# EAGLE design 150308-1-eRIC-Nitro-v1.2 (EAGLE 7.3.0)
NRS: 150308-1; REV: v1.1
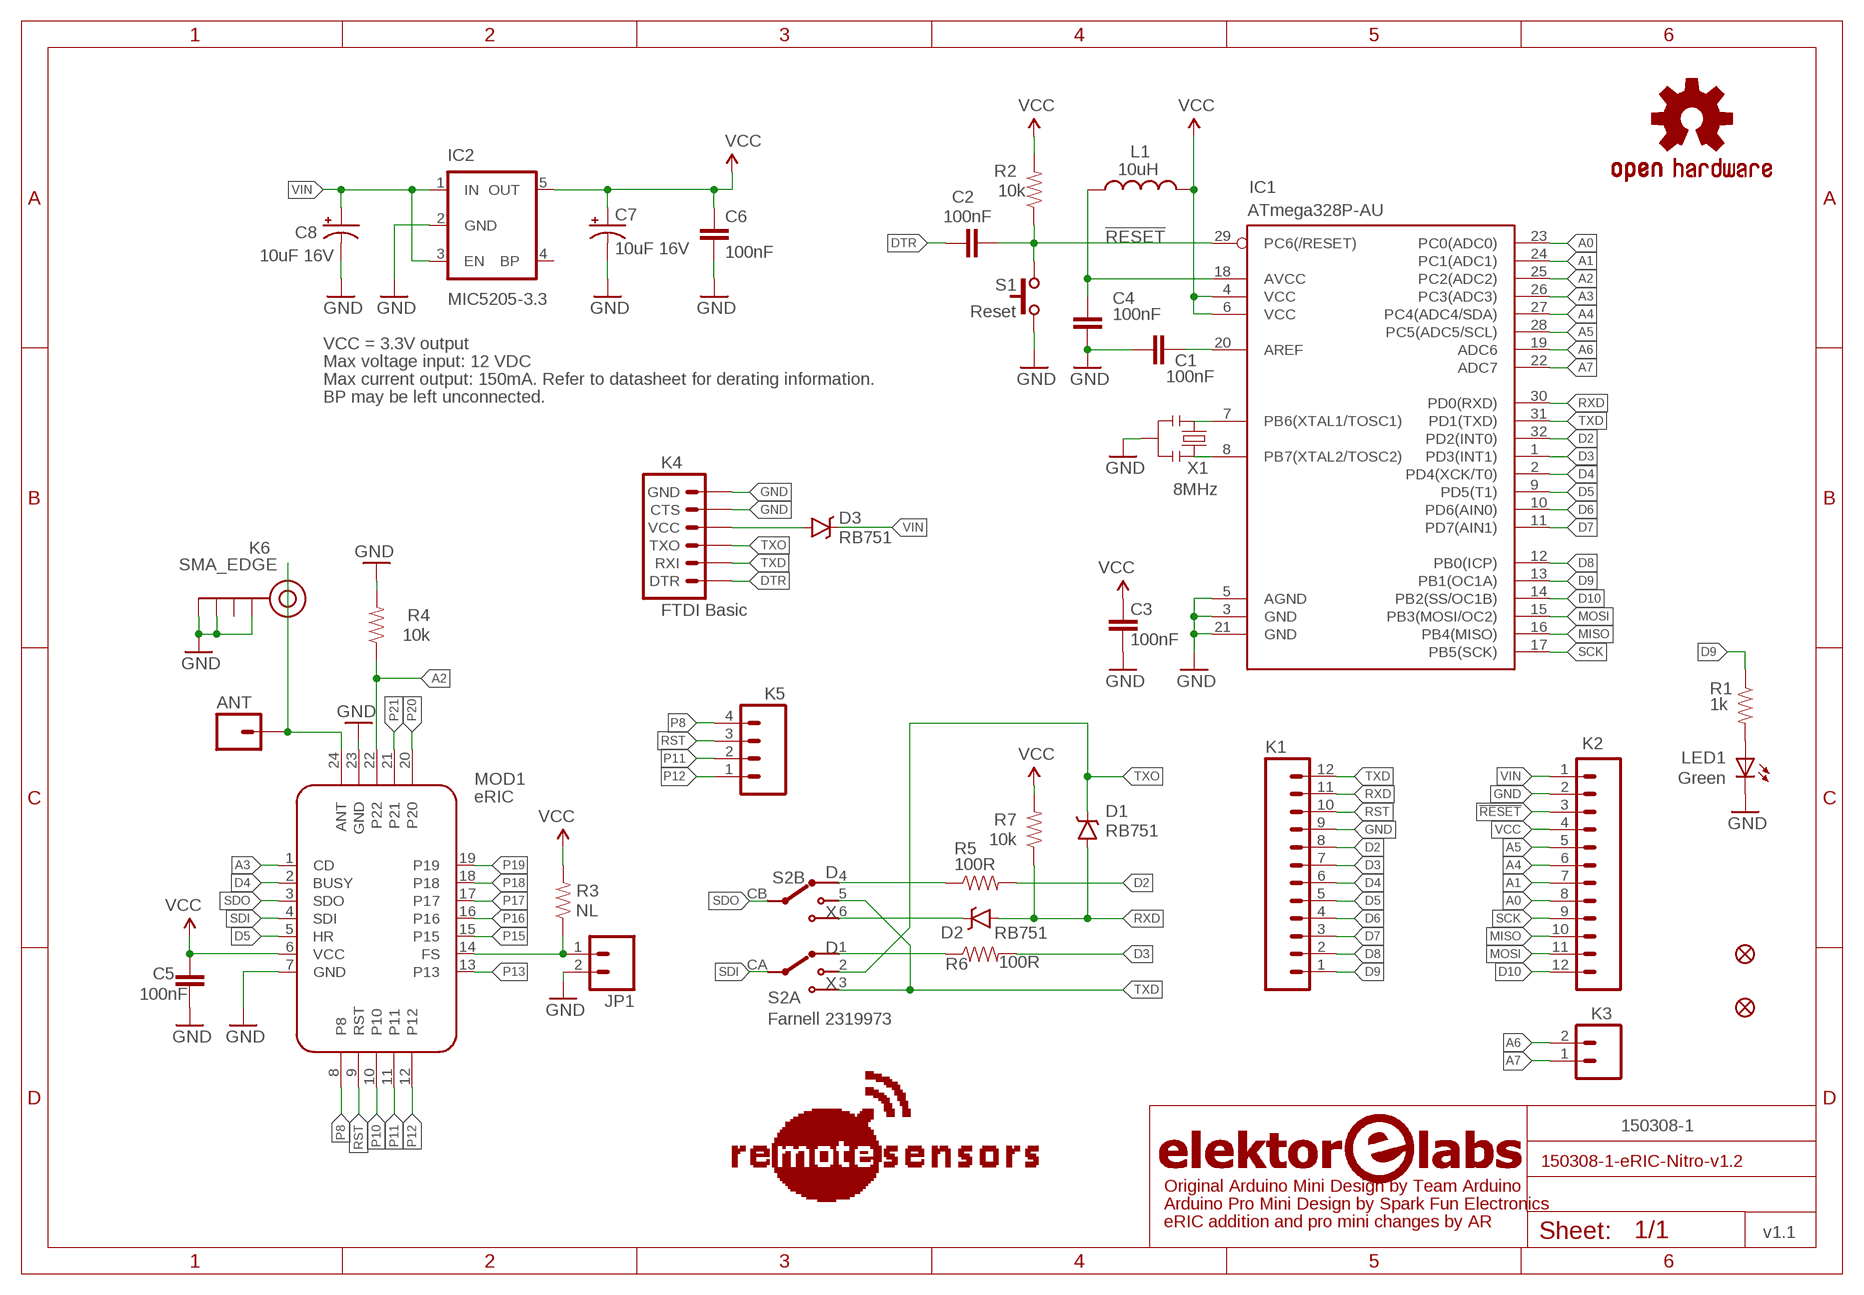
[diagram p0: schematic, sheet 1]

## Parts
ANT  M01PTH  [1X01-080]
C1  100nF  CAP0603-CAP  [0603-CAP]
C2  100nF  CAP0603-CAP  [0603-CAP]
C3  100nF  CAP0603-CAP  [0603-CAP]
C4  100nF  CAP0603-CAP  [0603-CAP]
C5  100nF  CAP0603-CAP  [0603-CAP]
C6  100nF  CAP0603-CAP  [0603-CAP]
C7  10uF 16V  CAP_POL1206  [EIA3216]
C8  10uF 16V  CAP_POL1206  [EIA3216]
D1  RB751  [SOD-523]
D2  RB751  [SOD-523]
D3  RB751  [SOD-523]
FID1  FIDUCIALUFIDUCIAL  [MICRO-FIDUCIAL]
FID2  FIDUCIALUFIDUCIAL  [MICRO-FIDUCIAL]
IC1  ATmega328P-AU  ATMEGA168  [TQFP32-08]
IC2  MIC5205-3.3  V_REG_LDOSMD  [SOT23-5]
JP1  M02PTH  [1X02]
K1  M12PTH  [1X12]
K2  M12PTH  [1X12]
K3  M02PTH  [1X02]
K4  FTDI Basic  ARDUINO_SERIAL_PROGRAMPTH  [1X06]
K5  M04PTH  [1X04]
K6  SMA_EDGE  [SMA-EDGE]
L1  10uH  INDUCTOR0603  [0603]
LED1  Green  LED  [0603-LED-ALT1]
LOGO1  OSHW-LOGOS  [OSHW-LOGO-S]
LOGO2  LOGO-ELEKTOR-LABS-25MM  [ELPP-LOGO-ELEKTOR-LABS-25MM]
LOGO3  LOGO-REMOTE-SENSORS-17MM  [LOGO-REMOTE-SENSORS2]
MOD1  eRIC  ERIC  [ERIC]
R1  1k  RESISTOR0603-RES  [0603-RES]
R2  10k  RESISTOR0603-RES  [0603-RES]
R3  NL  RESISTOR0603-RES  [0603-RES]
R4  10k  RESISTOR0603-RES  [0603-RES]
R5  100R  RESISTOR0603-RES  [0603-RES]
R6  100R  RESISTOR0603-RES  [0603-RES]
R7  10k  RESISTOR0603-RES  [0603-RES]
S1  Reset  SWITCH-MOMENTARY-2SMD-ALT04  [TACTILE-SWITCH-SMD-ALT04]
S2  AYZ0203AGRLC  [AYZ0203]
X1  8MHz  RESONATORSMD  [RESONATOR-SMD]

## Nets
!RESET!: C2.1 IC1.29(PC6(/RESET)) K2.3 R2.1 S1.3 S1.4
A0: IC1.23(PC0(ADC0)) K2.8
A1: IC1.24(PC1(ADC1)) K2.7
A2: IC1.25(PC2(ADC2)) MOD1.22 R4.1
A3: IC1.26(PC3(ADC3)) MOD1.1(CD)
A4: IC1.27(PC4(ADC4/SDA)) K2.6
A5: IC1.28(PC5(ADC5/SCL)) K2.5
A6: IC1.19(ADC6) K3.2
A7: IC1.22(ADC7) K3.1
ANTENNE: ANT.1 K6.SIG(SIGNAL) MOD1.24(ANT)
D2: IC1.32(PD2(INT0)) K1.8 R5.2
D3: IC1.1(PD3(INT1)) K1.7 R6.2
D4: IC1.2(PD4(XCK/T0)) K1.6 MOD1.2(BUSY)
D5: IC1.9(PD5(T1)) K1.5 MOD1.5(HR)
D6: IC1.10(PD6(AIN0)) K1.4
D7: IC1.11(PD7(AIN1)) K1.3
D8: IC1.12(PB0(ICP)) K1.2
D9: IC1.13(PB1(OC1A)) K1.1 R1.1
D10: IC1.14(PB2(SS/OC1B)) K2.12
DTR: C2.2 K4.1(DTR)
FS: JP1.1 MOD1.14(FS) R3.1
GND [vcc]: C1.1 C3.1 C4.1 C5.1 C6.2 C7.C(-) C8.C(-) IC1.3(GND) IC1.5(AGND) IC1.21(GND) IC2.2(GND) JP1.2 K1.9 K2.2 K4.5(CTS) K4.6(GND) K6.GND@0(GND) K6.GND@2(GND) K6.GND@3(GND) LED1.C MOD1.7(GND) MOD1.23(GND) R4.2 S1.1 S1.2 X1.2
MISO: IC1.16(PB4(MISO)) K2.10
MOSI: IC1.15(PB3(MOSI/OC2)) K2.11
N$1: IC1.8(PB7(XTAL2/TOSC2)) X1.3
N$2: IC1.7(PB6(XTAL1/TOSC1)) X1.1
N$3: C1.2 IC1.20(AREF)
N$4: C4.2 IC1.18(AVCC) L1.1
N$5: LED1.A R1.2
N$6: D3.A K4.4(VCC)
N$8: R5.1 S2.4
N$9: D2.C S2.6
N$10: R6.1 S2.1
P8: K5.4 MOD1.8
P10: MOD1.10
P11: K5.2 MOD1.11
P12: K5.1 MOD1.12
P13: MOD1.13
P15: MOD1.15
P16: MOD1.16
P17: MOD1.17
P18: MOD1.18
P19: MOD1.19
P20: MOD1.20
P21: MOD1.21
RST: K1.10 K5.3 MOD1.9(RST)
RXD: D1.A D2.A IC1.30(PD0(RXD)) K1.11 R7.1
SCK: IC1.17(PB5(SCK)) K2.9
SDI: MOD1.4(SDI) S2.CA
SDO: MOD1.3(SDO) S2.CB
TXD: IC1.31(PD1(TXD)) K1.12 K4.2(RXI) S2.3 S2.5
TXO: D1.C K4.3(TXO) S2.2
VCC: C3.2 C5.2 C6.1 C7.A(+) IC1.4(VCC) IC1.6(VCC) IC2.5(OUT) K2.4 L1.2 MOD1.6(VCC) R2.2 R3.2 R7.2
VIN [vcc]: C8.A(+) D3.C IC2.1(IN) IC2.3(EN) K2.1
Unconnected: IC2.4(BP) K6.GND@1(GND)

## Notes on the sheet
- VCC = 3.3V output
- Max voltage input: 12 VDC
- Max current output: 150mA. Refer to datasheet for derating information.
- BP may be left unconnected.
- D
- X
- D
- X
- Farnell 2319973
- Original Arduino Mini Design by Team Arduino
- Arduino Pro Mini Design by Spark Fun Electronics
- eRIC addition and pro mini changes by AR

## Library data of the parts
ANT = 150308-1-eRIC-Nitro:M01: Header 1 Standard 1-pin 0.1" header. Use with straight break away headers (SKU : PRT-00116), right angle break away headers (PRT-00553), swiss pins (PRT-00743), machine pins (PRT-00117), and female headers (PRT-00115).
C1-C6 = SparkFun:CAP: Capacitor Standard 0603 ceramic capacitor, and 0.1" leaded capacitor.
C7 C8 = 150308-1-eRIC-Nitro:CAP_POL: Capacitor Polarized These are standard SMD and PTH capacitors. Normally 10uF, 47uF, and 100uF in electrolytic and tantalum varieties. Always verify the external diameter of the through hole cap, it varies with capacity, voltage, and manufacturer. The EIA devices should be standard.
D1-D3 = 150308-1-eRIC-Nitro:RB751: 40V 120mA SOD-523 Schottky DIO-11018; PROD_ID: DIO-11018
FID1 FID2 = SparkFun:FIDUCIAL: Fiducial Alignment Points Various fiducial points for machine vision alignment.
IC1 = SparkFun:ATMEGA168
IC2 = 150308-1-eRIC-Nitro:V_REG_LDO: Voltage Regulator LDO Standard 150mA LDO voltage regulator in SOT-23 layout. Micrel part MIC5205. BP (by-pass) pin is used to lower output noise with 470pF cap.
JP1 K3 = 150308-1-eRIC-Nitro:M02: Header 2 Standard 2-pin 0.1" header. Use with straight break away headers (SKU : PRT-00116), right angle break away headers (PRT-00553), swiss pins (PRT-00743), machine pins (PRT-00117), and female headers (PRT-00115). Molex polarized connector foot print use with SKU : PRT-08233 with associated crimp pins and housings.
K1 K2 = 150308-1-eRIC-Nitro:M12: Header 12 Standard 12-pin 0.1" header. Use with straight break away headers (SKU : PRT-00116), right angle break away headers (PRT-00553), swiss pins (PRT-00743), machine pins (PRT-00117), and female headers (PRT-00115).
K4 = 150308-1-eRIC-Nitro:ARDUINO_SERIAL_PROGRAM
K5 = 150308-1-eRIC-Nitro:M04: Header 4 Standard 4-pin 0.1" header. Use with straight break away headers (SKU : PRT-00116), right angle break away headers (PRT-00553), swiss pins (PRT-00743), machine pins (PRT-00117), and female headers (PRT-00115). Molex polarized connector foot print use with SKU : PRT-08231 with associated crimp pins and housings. 1MM SMD Version SKU: PRT-10208
K6 = 150308-1-eRIC-Nitro:SMA_EDGE: SMA Antenna Connector End launch SMA connector. The paste layer has been removed so that the connector can be hand soldered onto the board after reflow.
L1 = SparkFun-Passives:INDUCTOR: Inductors Basic Inductor/Choke - 0603 and 1206. Footprints are not proven and vary greatly between part numbers. INDUCTOR POWER 3.3UH 4.0A SMD 0.197" L x 0.197" W x 0.177" H (5.00mm x 5.00mm x 4.50mm)
LED1 = 150308-1-eRIC-Nitro:LED: LEDs Standard schematic elements and footprints for 5mm, 3mm, 1206, and 0603 sized LEDs. 5mm - Spark Fun Electronics SKU : COM-00529 (and others)
LOGO1 = SparkFun:OSHW-LOGO: Open Source Hardware Logo This logo indicates the piece of hardware it is found on incorporates a OSHW license and/or adheres to the definition of open source hardware found here: http://freedomdefined.org/OSHW
LOGO2 = 150308-1-eRIC-Nitro:LOGO-ELEKTOR-LABS: Logo, Elektor.Labs
LOGO3 = _Elektor2a:LOGO-REMOTE-SENSORS-: Logo remotesensors
MOD1 = eRIC-Nitro:ERIC: eRIC SoC Radio Transceiver Low Power Radio Solutions ( http://www.lprs.co.uk ) VCC: -0.3 to +6.0V I/O: -0.3 to +3.3V Operating Temperature: -40°C to 85°C Antenna: 50V p-p @ < 10MHz
R1-R4 R7 = SparkFun:RESISTOR: Resistor Basic schematic elements and footprints for 0603, 1206, and PTH resistors.
R5 R6 = SparkFun-Resistors:RESISTOR: Resistor Basic schematic elements and footprints for 0603, 1206, and PTH resistors.
S1 = 150308-1-eRIC-Nitro:SWITCH-MOMENTARY-2: Various NO switches- pushbuttons, reed, etc
S2 = 150308-1-eRIC-Nitro:AYZ0203: DP3T slide switch Two 3-way slide switches in one SMD package. C&K Components, AYZ0203
X1 = 150308-1-eRIC-Nitro:RESONATOR: Resonator Small SMD resonator. This is the itty bitty 10/20MHz resonators with built in caps. CSTCE10M0G55 and CSTCE20M0V53. Footprint for SMD has been used in SFE production for years, and does work okay. 1:1 is an attempt to get larger fillets on the sides so it will be easier to inspect these solders in our AOI machine. The pads have been minimized to match the actual metal under the resonator. To see this relation, it includes an image import of the bottom side of the component. Imported to scale on layer 200.

## Net classes
0 default: width 0.203 mm
1 vcc: width 0.254 mm

## Board
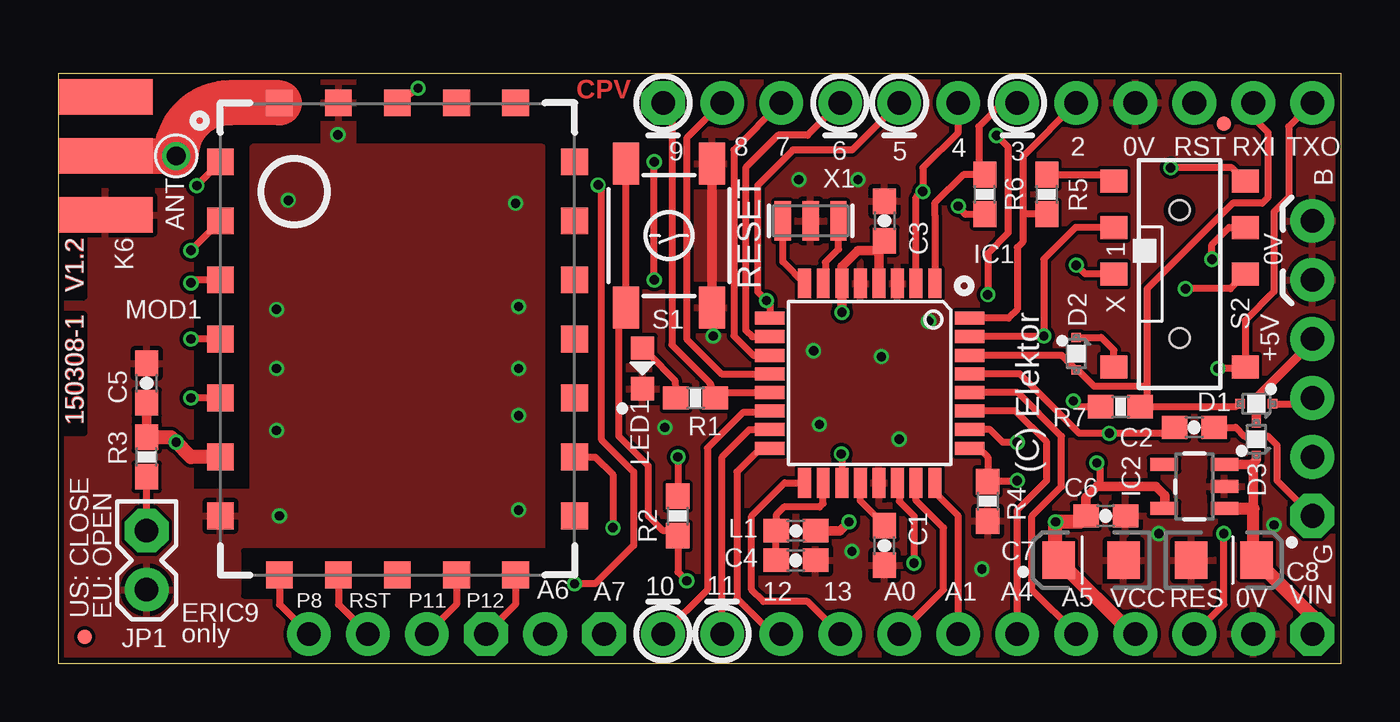
[diagram p1: board, top side]
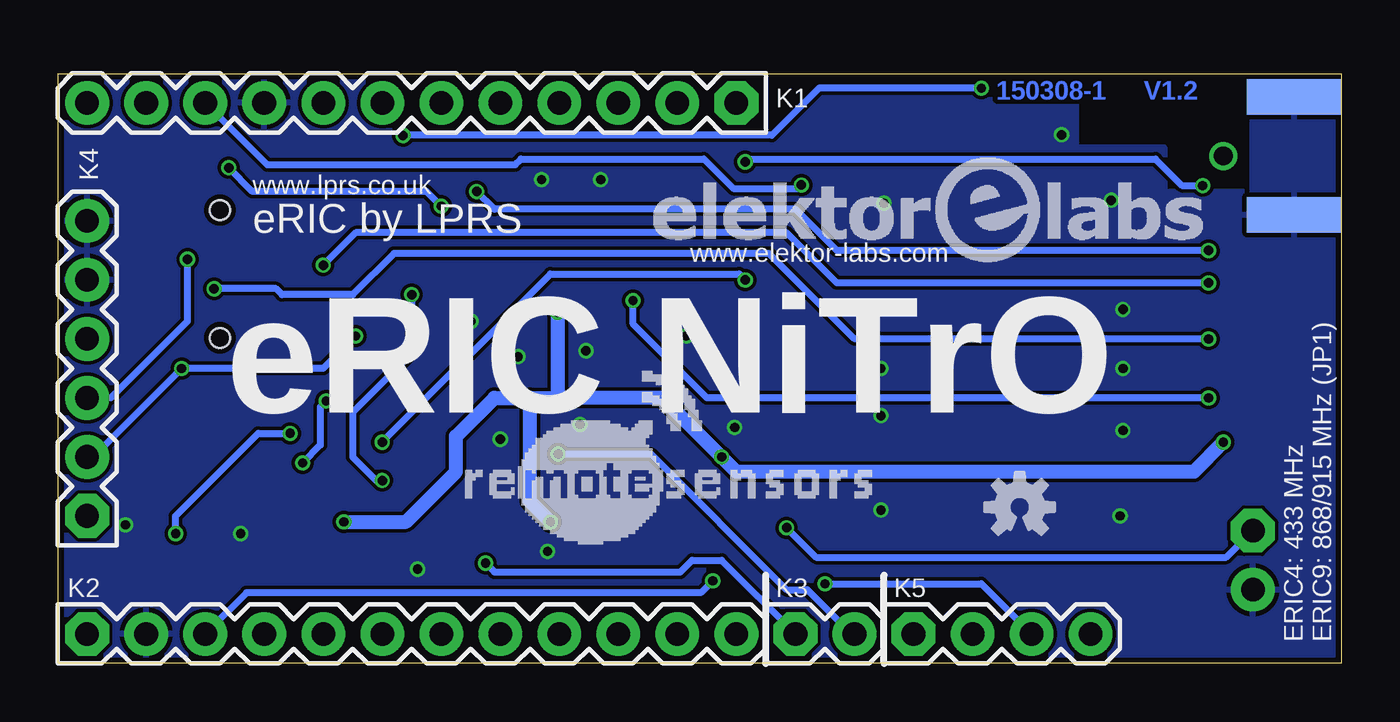
[diagram p2: board, bottom side, seen from below]

Size 55.23 x 25.39 mm. Coordinates in mm from the lower left corner, seen from the top.
Outline: 0,0 55.23,0 55.23,25.39 0,25.39 0,0
Copper layers (1*16): Top 0.018mm / dielectric 1.55mm / Bottom 0.018mm
Design rules "eC_2Layer_PClass6_BaseCopperO18_eCDefault *": minimum track width 0.15mm, minimum drill 0.35mm, track to track 0.15mm, track to pad 0.15mm, pad to pad 0.15mm, via to via 0.15mm, smd to smd 0mil, copper to edge 0.25mm, drill to drill 0.35mm, minimum pad ring 0.175mm, minimum via ring 0.125mm, stop-mask expansion 0mil, vias tented up to drill 0.5mm, thermal gap 0.2mm

### Footprints (pad centres in the part's own frame; a part is rotated, then mirrored left to right if it is on the bottom)
1X01-080 = drill 0.8: 1 0,0
0603-CAP = smd 1.1 x 1: 1 -0.85,0; 2 0.85,0
EIA3216 = smd 1.4 x 1.6: A 1.4,0; C -1.4,0
SOD-523 = smd 0.4 x 0.4: A -0.7,0; C 0.7,0
MICRO-FIDUCIAL = smd 0.635 x 0.635: 1 0,0
TQFP32-08 = smd 1.27 x 0.559: 1 -4.293,2.8; 2 -4.293,2; 3 -4.293,1.2; 4 -4.293,0.4; 5 -4.293,-0.4; 6 -4.293,-1.2; 7 -4.293,-2; 8 -4.293,-2.8; 17 4.293,-2.8; 18 4.293,-2; 19 4.293,-1.2; 20 4.293,-0.4; 21 4.293,0.4; 22 4.293,1.2; 23 4.293,2; 24 4.293,2.8 | smd 0.559 x 1.27: 9 -2.8,-4.293; 10 -2,-4.293; 11 -1.2,-4.293; 12 -0.4,-4.293; 13 0.4,-4.293; 14 1.2,-4.293; 15 2,-4.293; 16 2.8,-4.293; 25 2.8,4.293; 26 2,4.293; 27 1.2,4.293; 28 0.4,4.293; 29 -0.4,4.293; 30 -1.2,4.293; 31 -2,4.293; 32 -2.8,4.293
SOT23-5 = smd 0.55 x 1.2: 1 -0.95,-1.3; 2 0,-1.3; 3 0.95,-1.3; 4 0.95,1.3; 5 -0.95,1.3
1X02 = drill 1.016 pad 1.88 octagon: 1 0,0 | drill 1.016 pad 1.88: 2 2.54,0
1X12 = drill 1.016 pad 1.88 octagon: 1 0,0 | drill 1.016 pad 1.88: 2 2.54,0; 3 5.08,0; 4 7.62,0; 5 10.16,0; 6 12.7,0; 7 15.24,0; 8 17.78,0; 9 20.32,0; 10 22.86,0; 11 25.4,0; 12 27.94,0
1X06 = drill 1.016 pad 1.88 octagon: 1 0,0 | drill 1.016 pad 1.88: 2 2.54,0; 3 5.08,0; 4 7.62,0; 5 10.16,0; 6 12.7,0
1X04 = drill 1.016 pad 1.88 octagon: 1 0,0 | drill 1.016 pad 1.88: 2 2.54,0; 3 5.08,0; 4 7.62,0
SMA-EDGE = smd 1.524 x 4.064: GND@0 0,0; GND@1 5.08,0; SIG 2.54,0 | smd 1.524 x 4.064 bottom: GND@2 0,0; GND@3 5.08,0
0603 = smd 1.1 x 1: 1 -0.85,0; 2 0.85,0
0603-LED-ALT1 = smd 1 x 1: A 0,-0.877; C 0,0.877
ERIC = smd 1.15 x 1.15: 1 0,17.78; 2 0,15.24; 3 0,12.7; 4 0,10.16; 5 0,7.62; 6 0,5.08; 7 0,2.54; 8 2.54,0; 9 5.08,0; 10 7.62,0; 11 10.16,0; 12 12.7,0; 13 15.24,2.54; 14 15.24,5.08; 15 15.24,7.62; 16 15.24,10.16; 17 15.24,12.7; 18 15.24,15.24; 19 15.24,17.78; 20 12.7,20.32; 21 10.16,20.32; 22 7.62,20.32; 23 5.08,20.32; 24 2.54,20.32
0603-RES = smd 1.1 x 1: 1 -0.85,0; 2 0.85,0
TACTILE-SWITCH-SMD-ALT04 = smd 1.8 x 1.1: 1 -3.1,1.85; 2 3.1,1.85; 3 -3.1,-1.85; 4 3.1,-1.85
AYZ0203 = smd 1 x 1.15: 1 -4,2.825; 2 -2,2.825; 3 4,2.825; 4 -4,-2.825; 5 -2,-2.825; 6 4,-2.825; CA 0,2.825; CB 0,-2.825 | hole 0.85: 2.75,0; -2.75,0
RESONATOR-SMD = smd 0.7 x 1.7: 1 -1.2,0; 2 0,0; 3 1.2,0

### Placement (x,y rotation side)
ANT  5.08,21.84 90 top
C1  35.56,5.08 90 top
C2  48.89,10.16 0 top
C3  35.56,19.05 270 top
C4  31.75,4.45 180 top
C5  3.81,12.06 270 top
C6  45.09,6.35 0 top
C7  44.45,4.45 180 top
C8  50.16,4.45 0 top
D1  51.56,11.18 0 top
D2  43.81,13.34 90 top
D3  51.56,9.65 270 top
FID1  50.16,23.24 90 top
FID2  1.14,1.14 90 top
IC1  34.92,12.06 270 top
IC2  48.89,7.62 90 top
JP1  3.81,5.71 270 top
K1  26.04,24.13 180 bottom
K2  53.98,1.27 0 bottom
K3  23.5,1.27 0 bottom
K4  53.98,6.35 90 bottom
K5  18.41,1.27 0 bottom
K6  2.03,19.3 90 top
L1  31.75,5.71 0 top
LED1  25.15,12.7 180 top
LOGO1  13.84,6.73 0 bottom
LOGO2  16.26,19.68 0 bottom
LOGO3  37.72,7.11 0 bottom
MOD1  6.98,3.81 0 top
R1  27.43,11.43 180 top
R2  26.67,6.35 90 top
R3  3.81,8.89 90 top
R4  40.01,6.99 270 top
R5  42.55,20.19 270 top
R6  39.88,20.19 90 top
R7  45.72,11.05 180 top
S1  26.29,18.41 270 top
S2  48.26,16.76 270 top
X1  32.38,19.05 180 top

### Tracks (layer width: path | path; a pad name or v marks a point on that pad's centre or on a via)
!RESET!  (via drill 0.4)
  Top 0.305: C2.1 48.13,10.16 47.88,9.91 v45.24,9.91 43.94,9.91 41.38,12.46 IC1.29 | K2.3 50.16,2.54 v50.16,5.59 | S1.3 S1.4 24.51,15.24 24.13,14.86 24.13,9.78 25.4,8.51 25.4,6.35 26.04,5.71 26.46,5.71 R2.1 26.67,3.94 v27.05,3.56
  Bottom 0.305: v50.16,5.59 50.16,6.35 46.61,9.91 v45.24,9.91 | v27.05,3.56 27.56,3.05 47.12,3.05 K2.3
A0
  Top 0.305: K2.8 38.1,3.17 38.1,5.84 36.92,7.02 IC1.23
A1
  Top 0.305: K2.7 38.73,6.35 37.73,7.36 IC1.24
A2  (via drill 0.4)
  Top 0.305: 39.37,9.11 IC1.25 39.63,9.27 40.01,8.89 R4.1 41.24,7.83 v41.28,7.87 | MOD1.22 v15.49,24.77 | v40.01,15.88 40.01,17.65 40.89,18.54 40.89,22.23 v40.39,22.73
  Bottom 0.305: v15.49,24.77 22.48,24.77 24.51,22.73 v40.39,22.73 | v40.01,15.88 40.01,13.34 42.55,10.79 42.55,8.89 41.53,7.87 v41.28,7.87
A3  (via drill 0.4)
  Top 0.305: MOD1.1 v5.97,20.57 | IC1.26 40.1,10.06 40.64,9.53 v41.28,9.53 | v25.65,16.51 v25.65,21.59
  Bottom 0.305: v41.28,9.53 34.04,16.76 25.91,16.76 v25.65,16.51 | v25.65,21.59 25.53,21.59 25.53,21.72 8,21.72 6.86,20.57 v5.97,20.57
A4
  Top 0.305: K2.6 41.28,6.6 42.55,7.87 42.55,9.53 41.2,10.87 IC1.27
A5
  Top 0.305: K2.5 41.91,3.17 41.91,6.35 43.18,7.62 43.18,9.78 41.29,11.66 IC1.28
A6  (via drill 0.4)
  Top 0.305: v33.71,9.02 33.73,8.82 IC1.19
  Bottom 0.305: v33.71,9.02 29.72,9.02 23.88,3.17 22.99,3.17 21.08,1.27 K3.2
A7  (via drill 0.4)
  Top 0.305: IC1.22 36.2,7.7 36.2,6.99 36.83,6.35 v36.83,4.32
  Bottom 0.305: v36.83,4.32 36.45,3.94 28.45,3.94 27.94,4.45 26.67,4.45 K3.1
ANTENNE
  Top 1.524: K6.SIG ANT.1
  Top 1.93: MOD1.24 7.37,24.13 arc90 ANT.1
D2
  Top 0.305: IC1.32 40.9,14.87 41.28,15.24 41.28,17.91 41.53,18.16 41.53,19.3 | 42.8,19.3 42.84,19.34 R5.2 41.57,19.34 41.53,19.3 | 41.53,19.3 41.53,21.84 K1.8
D3
  Top 0.305: IC1.1 37.73,19.31 37.72,19.32 37.72,19.81 38.95,21.04 R6.2 39.62,21.3 39.62,23.11 40.64,24.13 K1.7
D4  (via drill 0.4)
  Top 0.305: IC1.2 36.92,20.07 v37.21,20.32 37.21,21.34 38.73,22.86 K1.6 | MOD1.2 v5.71,17.78
  Bottom 0.305: v5.71,17.78 21.72,17.78 23.5,19.56 36.45,19.56 v37.21,20.32
D5  (via drill 0.4)
  Top 0.305: MOD1.5 v5.71,11.43 | IC1.9 30.63,15.47 v30.48,15.62 30.1,16 30.1,20.57 31.62,22.1 34.16,22.1 K1.5
  Bottom 0.305: v5.71,11.43 27.3,11.43 30.48,14.61 v30.48,15.62
D6
  Top 0.305: K1.4 32.26,22.73 30.99,22.73 29.59,21.34 29.59,14.35 29.88,14.06 IC1.10
D7
  Top 0.305: K1.3 29.08,22.1 29.08,14.1 29.91,13.27 IC1.11
D8
  Top 0.305: K1.2 27.05,22.61 27.05,13.97 28.56,12.46 IC1.12
D9
  Top 0.305: K1.1 26.42,23.62 26.42,13.72 28.03,12.1 R1.1 28.26,11.66 IC1.13
D10
  Top 0.305: IC1.14 30.56,10.79 29.46,10.79 27.94,9.27 27.94,3.17 K2.12
DTR
  Top 0.305: C2.2 50.67,10.16 51.05,9.78 52.07,9.78 52.45,9.4 52.45,7.87 K4.1
FS  (via drill 0.4)
  Top 0.305: JP1.1 R3.1 | MOD1.14 23.11,8.89 23.88,8.13 v23.88,5.84
  Bottom 0.305: v23.88,5.84 22.61,4.57 4.95,4.57 JP1.1
GND  (via drill 0.4)
  Top 0.305: C3.1 35.56,20.07
  Top 0.406: S1.1 S1.2
  other vias: 36.2,9.65 26.11,10.16 28.19,14.1 31.88,20.83 35.43,13.21 9.53,6.35 39.75,4.06 34.16,4.83 32.51,13.46 32.77,10.29 9.4,15.24 19.81,15.37 19.81,12.7 19.81,10.67 19.81,6.6 19.69,19.81 9.4,12.7 9.4,10.03 37.47,14.73 47.37,5.59 9.91,19.94 52.32,5.97 12.04,22.76 34.42,20.83
  pour Bottom: 0,0 55.25,0 55.25,25.4 11.43,25.4 11.43,22.23 7.62,22.23 7.62,20.32 3.81,20.32 3.81,25.4 0,25.4
  pour Top: 0,0 55.25,0 55.25,25.4 21.59,25.4 21.59,23.5 23.5,23.5 23.5,4.7 20.83,4.7 20.83,22.23 12.7,22.23 12.7,25.4 11.43,25.4 11.43,22.23 8.38,22.23 8.38,7.37 5.71,7.37 5.71,20.32 0,20.32
  cutout Top: 8,2.92 21.08,2.92 21.08,4.83 8,4.83
MISO
  Top 0.305: K2.10 30.73,1.27 29.21,2.79 29.21,8.26 30.22,9.27 IC1.16
MOSI
  Top 0.305: K2.11 28.57,8.89 29.75,10.06 IC1.15
N$1
  Top 0.305: IC1.8 31.19,17.3 X1.3
N$2
  Top 0.305: IC1.7 33.02,16.45 33.02,17.27 33.59,17.84 X1.1
N$3
  Top 0.305: C1.2 35.56,5.97 34.52,7 IC1.20
N$4
  Top 0.305: IC1.18 32.92,6.89 32.77,6.73 31.24,6.73 30.9,6.39 L1.1 C4.2
N$5
  Top 0.305: LED1.A 25.01,13.34 25.4,13.34 26.54,12.19 R1.2
N$6
  Top 0.406: D3.A 51.56,11.43 53.98,13.84 K4.4
N$8
  Top 0.305: R5.1 45.16,21.04 S2.4
N$9
  Top 0.305: 43.81,13.97 D2.C 44.89,14.04 45.44,13.49 S2.6
N$10  (via drill 0.4)
  Top 0.305: v38.73,19.68 39.03,19.34 R6.1 | S2.1 50.51,21.34 v47.88,21.34
  Bottom 0.305: v38.73,19.68 39.37,20.32 46.86,20.32 v47.88,21.34
P8
  Top 0.305: MOD1.8 9.53,2.54 K5.4
P11
  Top 0.305: MOD1.11 17.14,2.54 K5.2
P12
  Top 0.305: MOD1.12 19.69,2.54 K5.1
RST  (via drill 0.4)
  Top 0.305: MOD1.9 12.07,2.54 K5.3 | v23.24,20.6 23.37,20.45 23.37,9.65 24.77,8.26 24.77,5.08 23.11,3.43 v22.23,3.43
  Bottom 0.305: v23.24,20.6 23.37,20.45 26.16,20.45 27.43,21.72 35.31,21.72 35.56,21.46 46.23,21.46 K1.10 | v22.23,3.43 15.49,3.43 K5.3
RXD
  Top 0.305: IC1.30 43.19,13.27 D2.A 43.88,12.63 44.58,11.94 46.86,11.94 | 46.86,11.94 46.86,11.34 R7.1 | 46.86,11.94 46.86,16.13 50.55,19.81 51.82,19.81 52.07,20.07 52.07,22.86 51.44,23.5 K1.11 | D1.A 50.8,11.18 50.67,11.05 R7.1 | 46.95,11.43 R7.1
SCK
  Top 0.305: K2.9 32.26,2.67 30.35,2.67 29.84,3.17 29.84,6.35 31.27,7.77 IC1.17
SDI  (via drill 0.4)
  Top 0.305: MOD1.4 v5.71,13.97 | S2.CA 50.45,16.13 v48.51,16.13
  Bottom 0.305: v5.71,13.97 20.96,13.97 24.64,17.65 40.77,17.65 42.55,15.88 45.59,15.88 45.85,16.13 v48.51,16.13
SDO  (via drill 0.4)
  Top 0.305: MOD1.3 5.84,16.51 5.84,16.38 v5.71,16.38 | S2.CB 44.2,16.76 v43.81,17.14
  Bottom 0.305: v5.71,16.38 21.72,16.38 23.88,18.54 42.42,18.54 v43.81,17.14
TXD  (via drill 0.4)
  Top 0.305: K1.12 52.96,23.11 52.96,20.07 52.32,19.43 52.32,16 51.09,14.76 S2.3 51.02,12.7 v49.91,12.7 | IC1.31 42.13,14.06 v42.42,14.1 42.42,17.4 43.78,18.76 S2.5
  Bottom 0.305: v42.42,14.1 43.81,12.7 v49.91,12.7 53.72,8.89 K4.2
TXO  (via drill 0.4)
  Top 0.305: D1.C 53.72,11.18 K4.3 | v49.66,17.4 49.66,18.03 50.39,18.76 S2.2
  Bottom 0.305: K4.3 52.96,11.43 49.66,14.73 v49.66,17.4
VCC  (via drill 0.4)
  Top 0.305: R7.2 43.94,11.05 v43.69,11.3 | v26.67,8.89 R2.2 | v44.7,8.64 44.83,8.51 44.83,7.62
  Top 0.406: 44.45,6.57 C6.1 | 44.32,6.26 C6.1 | C6.1 | C3.2 35.34,18.41 | C3.2 35.33,17.96 IC1.4 | IC1.6 33.66,16.43 | C7.A 43.18,4.58 | v33.73,15.11 33.73,15.18 IC1.6 | 47.41,6.67 IC2.5 47.62,6.7 47.62,7.24 47.24,7.62 44.83,7.62 44.7,7.62 44.23,7.15 C6.1 | C5.2 R3.2 | L1.2 33.66,5.71 v34.04,6.1 | IC1.6 33.73,17.09 34.42,17.78 35.31,17.78 35.34,18.2 C3.2
  Top 0.61: 43.18,4.58 42.93,4.83 v42.93,6.1 43.99,6.1 C6.1 | R3.2 4.87,9.74 v5.08,9.53 5.71,8.89 MOD1.6 | C7.A 46.23,1.27 K2.4
  Bottom 0.305: v43.69,11.3 43.94,11.05 43.94,9.4 v44.7,8.64
  Bottom 0.61: v33.73,15.11 33.73,11.43 | v42.93,6.1 40.26,6.1 38.1,8.26 38.1,9.78 36.45,11.43 34.92,11.43 | 34.92,11.43 33.73,11.43 | v5.08,9.53 6.35,8.26 26.04,8.26 v26.67,8.89 29.21,11.43 33.73,11.43 | v34.04,6.1 34.92,6.99 34.92,11.43
VIN
  Top 0.406: C8.A 51.44,4.58 | D3.C 51.56,8.76 51.44,8.64 | 51.44,8.64 51.44,6.67 | IC2.3 51.37,8.57 51.44,8.64
  Top 0.508: IC2.1 51.44,6.67 51.44,4.58
  Top 0.61: C8.A 53.98,2.04 K2.1

### Text on the board
tPlace: 9 | 8 | 7 | 6 | 5 | 4 | 3 | 2 | 0V | RST | RXI | TXO | B | 1 | 0V | RESET | X | +5V | G | A6 | A7 | 10 | 11 | 12 | 13 | A0 | A1 | A4 | VIN | US: CLOSE | EU: OPEN | ERIC9 | P8 | RST | P11 | P12 | A5 | VCC | RES | 0V | only
bPlace: www.lprs.co.uk | eRIC by LPRS | www.elektor-labs.com | eRIC NiTrO | ERIC4: 433 MHz / ERIC9: 868/915 MHz (JP1)